# Altium schematic sheet EXT_LED.SchDoc: {Наименование}
size 420 x 297 mm; ApprovedBy: {Утвердил}; CheckedBy: {Проверил}; DrawnBy: {Разраб.}; DocumentNumber: АБВГ 123456.789 00; SheetNumber: 8; SheetTotal: {}; Scale: {Мш.}; PageSetup: Record=PageOptions|CenterHorizontal=False|CenterVertical=False|PrintScale=0.95|XCorrection=0.00|YCorrection=0.00|PrintKind=1|BorderSize=5000000|LeftOffset=0|BottomOffset=0|Orientation=1|PaperLength=1000|PaperWidth=1000|Scale=100|PaperSource=15|PrintQuality=600|MediaType=1|DitherType=10|PaperKind=A4|PrintScaleMode=1; ProcessInspection: {Т.контр.}; Mass: {М.}; NormInspection: {Н.контр.}; Letter1Column: {}; Letter2Column: {}; Letter3Column: {}; DocumentType: {Документ}; Rule: PcbType=ProtelPcb
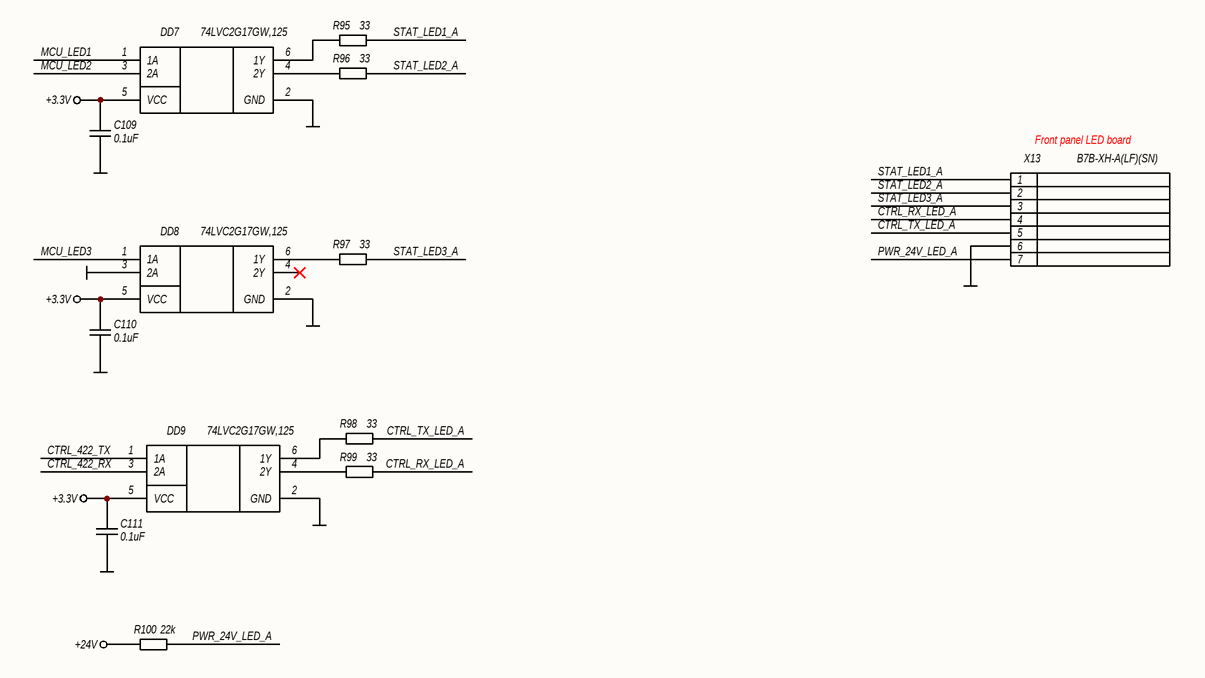
[diagram p0: EXT_LED.SchDoc]

## Parts
C109  0.1uF  [C0603N]
C110  0.1uF  [C0603N]
C111  0.1uF  [C0603N]
DD7  74LVC2G17GW,125  [SOT363-2]
DD8  74LVC2G17GW,125  [SOT363-2]
DD9  74LVC2G17GW,125  [SOT363-2]
R95  33  [R0603N]
R96  33  [R0603N]
R97  33  [R0603N]
R98  33  [R0603N]
R99  33  [R0603N]
R100  22k  [R0603N]
X13  B7B-XH-A(LF)(SN)  [B7B-XH-A]

## Nets
+3.3V: C109.2 C110.2 C111.2 DD7.5(VCC) DD8.5(VCC) DD9.5(VCC)
+24V: R100.2
GND: C109.1 C110.1 C111.1 DD7.2(GND) DD8.2(GND) DD8.3(2A) DD9.2(GND) X13.6
CTRL_422_RX: DD9.3(2A)
CTRL_422_TX: DD9.1(1A)
CTRL_RX_LED_A: R99.2 X13.4
CTRL_TX_LED_A: R98.2 X13.5
MCU_LED1: DD7.1(1A)
MCU_LED2: DD7.3(2A)
MCU_LED3: DD8.1(1A)
PWR_24V_LED_A: R100.1 X13.7
STAT_LED1_A: R95.2 X13.1
STAT_LED2_A: R96.2 X13.2
STAT_LED3_A: R97.2 X13.3
NetDD7_4: DD7.4(2Y) R96.1
NetDD7_6: DD7.6(1Y) R95.1
NetDD8_6: DD8.6(1Y) R97.1
NetDD9_4: DD9.4(2Y) R99.1
NetDD9_6: DD9.6(1Y) R98.1

Not connected (* = marked no-connect by the designer): DD8 4(2Y)*

## Notes on the sheet
- (near X13) Front panel LED board
- Подп. и дата
- Инв. № дубл.
- Взам. инв. №
- Инв. № подл.
- Лист
- Изм.
- № докум.
- Подп.
- Дата
- Копировал
- Формат А3

## Library data of the parts
C109-C111 = CL10B104KB8NNNC: Конденсатор; Точность: 10%; Напряжение: 50V; Диэлектрик: X7R; Производитель: Samsung Electro-Mechanics; Описание: 0.1 µF ±10% 50V Ceramic Capacitor X7R 0603 (1608 Metric); Корпус: 0603 (1608 Metric); Температурный диапазон: -55°C ~ 125°C; Вид монтажа: SMD; Артикул: CL10B104KB8NNNC; Номинал: 0.1uF; Строка для документации: https://mm.digikey.com/Volume0/opasdata/d220001/medias/docus/609/CL10B104KB8NNNC_Spec.pdf; Тип элемента: Конденсатор
DD7-DD9 = 74LVC2G17GW,125: Микросхема сдвоенный триггер Шмитта; Производитель: Nexperia USA Inc.; Описание: Buffer, Non-Inverting 2 Element 1 Bit per Element Push-Pull Output 6-TSSOP; Корпус: 6-TSSOP; Температурный диапазон: -40°C ~ 125°C (TA); Вид монтажа: SMD; Артикул: 74LVC2G17GW,125; Строка для документации: https://assets.nexperia.com/documents/data-sheet/74LVC2G17.pdf; Тип элемента: Микросхема
R95-R99 = RC0603FR-0733RL: Резистор; Точность: 1%; ТКС: ±100ppm/°C; Напряжение: 75V; Производитель: YAGEO; Описание: 33 Ohms ±1% 0.1W, 1/10W Chip Resistor 0603 (1608 Metric) Moisture Resistant Thick Film; Корпус: 0603 (1608 Metric); Температурный диапазон: -55°C ~ 155°C; Вид монтажа: SMD; Артикул: RC0603FR-0733RL; Номинал: 33; Строка для документации: https://www.yageo.com/upload/media/product/app/datasheet/rchip/pyu-rc_group_51_rohs_l.pdf; Тип элемента: Резистор
R100 = RC0603FR-0722KL: Резистор; Точность: 1%; ТКС: ±100ppm/°C; Напряжение: 75V; Производитель: YAGEO; Описание: 22 kOhms ±1% 0.1W, 1/10W Chip Resistor 0603 (1608 Metric) Moisture Resistant Thick Film; Корпус: 0603 (1608 Metric); Температурный диапазон: -55°C ~ 155°C; Вид монтажа: SMD; Артикул: RC0603FR-0722KL; Номинал: 22k; Строка для документации: https://www.yageo.com/upload/media/product/app/datasheet/rchip/pyu-rc_group_51_rohs_l.pdf; Тип элемента: Резистор
X13 = B7B-XH-A(LF)(SN): Разъем, 7 контактов; Тип разъема: Header, Male Pin; Количество контактов: 7; Шаг контактов: 2.5mm; Ток: 3A; Напряжение: 250V; Производитель: JST Sales America Inc.; Описание: Connector Header Through Hole 7 position 0.098" (2.50mm); Температурный диапазон: -25°C ~ 85°C; Вид монтажа: Through Hole; Артикул: B7B-XH-A(LF)(SN); Строка для документации: https://www.jst-mfg.com/product/pdf/eng/eXH.pdf; Тип элемента: Разъем